# EAGLE schematic Yocto v2.007 (EAGLE 6.1), part 3 of 3
## Sheet 18 of 18: Mods
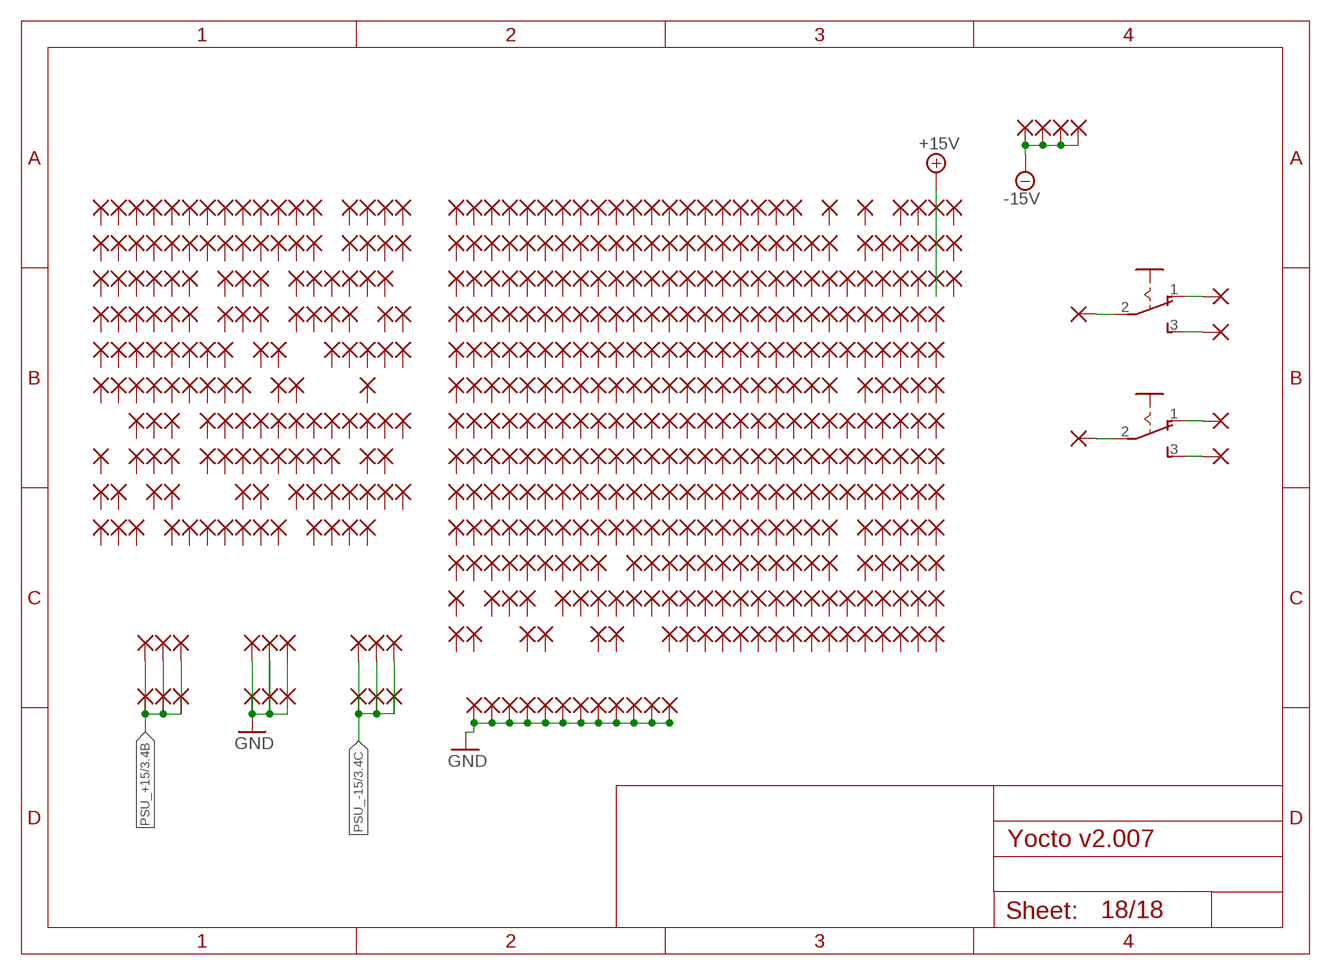
[diagram p18: schematic, sheet 18]

### Parts
MSW1  MSS12  [MSS12_SW_SLIDE]
MSW2  MSS12  [MSS12_SW_SLIDE]
PAD1  1,6/0,8  [1.6/0.8ROUND]
PAD2  1,6/0,8  [1.6/0.8ROUND]
PAD3  1,6/0,8  [1.6/0.8ROUND]
PAD4  1,6/0,8  [1.6/0.8ROUND]
PAD5  1,6/0,8  [1.6/0.8ROUND]
PAD6  1,6/0,8  [1.6/0.8ROUND]
PAD7  1,6/0,8  [1.6/0.8ROUND]
PAD8  1,6/0,8  [1.6/0.8ROUND]
PAD9  1,6/0,8  [1.6/0.8ROUND]
PAD10  1,6/0,8  [1.6/0.8ROUND]
PAD11  1,6/0,8  [1.6/0.8ROUND]
PAD12  1,6/0,8  [1.6/0.8ROUND]
PAD13  1,6/0,8  [1.6/0.8ROUND]
PAD14  1,6/0,8  [1.6/0.8ROUND]
PAD15  1,6/0,8  [1.6/0.8ROUND]
PAD16  1,6/0,8  [1.6/0.8ROUND]
PAD17  1,6/0,8  [1.6/0.8ROUND]
PAD18  1,6/0,8  [1.6/0.8ROUND]
PAD19  1,6/0,8  [1.6/0.8ROUND]
PAD20  1,6/0,8  [1.6/0.8ROUND]
PAD21  1,6/0,8  [1.6/0.8ROUND]
PAD22  1,6/0,8  [1.6/0.8ROUND]
PAD23  1,6/0,8  [1.6/0.8ROUND]
PAD24  1,6/0,8  [1.6/0.8ROUND]
PAD25  1,6/0,8  [1.6/0.8ROUND]
PAD26  1,6/0,8  [1.6/0.8ROUND]
PAD27  1,6/0,8  [1.6/0.8ROUND]
PAD28  1,6/0,8  [1.6/0.8ROUND]
PAD29  1,6/0,8  [1.6/0.8ROUND]
PAD30  1,6/0,8  [1.6/0.8ROUND]
PAD31  1,6/0,8  [1.6/0.8ROUND]
PAD32  1,6/0,8  [1.6/0.8ROUND]
PAD33  1,6/0,8  [1.6/0.8ROUND]
PAD34  1,6/0,8  [1.6/0.8ROUND]
PAD35  1,6/0,8  [1.6/0.8ROUND]
PAD36  1,6/0,8  [1.6/0.8ROUND]
PAD37  1,6/0,8  [1.6/0.8ROUND]
PAD38  1,6/0,8  [1.6/0.8ROUND]
PAD39  1,6/0,8  [1.6/0.8ROUND]
PAD40  1,6/0,8  [1.6/0.8ROUND]
PAD41  1,6/0,8  [1.6/0.8ROUND]
PAD42  1,6/0,8  [1.6/0.8ROUND]
PAD43  1,6/0,8  [1.6/0.8ROUND]
PAD44  1,6/0,8  [1.6/0.8ROUND]
PAD45  1,6/0,8  [1.6/0.8ROUND]
PAD46  1,6/0,8  [1.6/0.8ROUND]
PAD47  1,6/0,8  [1.6/0.8ROUND]
PAD48  1,6/0,8  [1.6/0.8ROUND]
PAD49  1,6/0,8  [1.6/0.8ROUND]
PAD50  1,6/0,8  [1.6/0.8ROUND]
PAD51  1,6/0,8  [1.6/0.8ROUND]
PAD52  1,6/0,8  [1.6/0.8ROUND]
PAD53  1,6/0,8  [1.6/0.8ROUND]
PAD54  1,6/0,8  [1.6/0.8ROUND]
PAD55  1,6/0,8  [1.6/0.8ROUND]
PAD56  1,6/0,8  [1.6/0.8ROUND]
PAD57  1,6/0,8  [1.6/0.8ROUND]
PAD58  1,6/0,8  [1.6/0.8ROUND]
PAD59  1,6/0,8  [1.6/0.8ROUND]
PAD60  1,6/0,8  [1.6/0.8ROUND]
PAD61  1,6/0,8  [1.6/0.8ROUND]
PAD62  1,6/0,8  [1.6/0.8ROUND]
PAD63  1,6/0,8  [1.6/0.8ROUND]
PAD64  1,6/0,8  [1.6/0.8ROUND]
PAD65  1,6/0,8  [1.6/0.8ROUND]
PAD66  1,6/0,8  [1.6/0.8ROUND]
PAD67  1,6/0,8  [1.6/0.8ROUND]
PAD68  1,6/0,8  [1.6/0.8ROUND]
PAD69  1,6/0,8  [1.6/0.8ROUND]
PAD70  1,6/0,8  [1.6/0.8ROUND]
PAD71  1,6/0,8  [1.6/0.8ROUND]
PAD72  1,6/0,8  [1.6/0.8ROUND]
PAD73  1,6/0,8  [1.6/0.8ROUND]
PAD74  1,6/0,8  [1.6/0.8ROUND]
PAD75  1,6/0,8  [1.6/0.8ROUND]
PAD76  1,6/0,8  [1.6/0.8ROUND]
PAD77  1,6/0,8  [1.6/0.8ROUND]
PAD78  1,6/0,8  [1.6/0.8ROUND]
PAD79  1,6/0,8  [1.6/0.8ROUND]
PAD80  1,6/0,8  [1.6/0.8ROUND]
PAD81  1,6/0,8  [1.6/0.8ROUND]
PAD82  1,6/0,8  [1.6/0.8ROUND]
PAD83  1,6/0,8  [1.6/0.8ROUND]
PAD84  1,6/0,8  [1.6/0.8ROUND]
PAD85  1,6/0,8  [1.6/0.8ROUND]
PAD86  1,6/0,8  [1.6/0.8ROUND]
PAD87  1,6/0,8  [1.6/0.8ROUND]
PAD88  1,6/0,8  [1.6/0.8ROUND]
PAD89  1,6/0,8  [1.6/0.8ROUND]
PAD90  1,6/0,8  [1.6/0.8ROUND]
PAD91  1,6/0,8  [1.6/0.8ROUND]
PAD92  1,6/0,8  [1.6/0.8ROUND]
PAD93  1,6/0,8  [1.6/0.8ROUND]
PAD94  1,6/0,8  [1.6/0.8ROUND]
PAD95  1,6/0,8  [1.6/0.8ROUND]
PAD96  1,6/0,8  [1.6/0.8ROUND]
PAD97  1,6/0,8  [1.6/0.8ROUND]
PAD98  1,6/0,8  [1.6/0.8ROUND]
PAD99  1,6/0,8  [1.6/0.8ROUND]
PAD100  1,6/0,8  [1.6/0.8ROUND]
PAD101  1,6/0,8  [1.6/0.8ROUND]
PAD102  1,6/0,8  [1.6/0.8ROUND]
PAD103  1,6/0,8  [1.6/0.8ROUND]
PAD104  1,6/0,8  [1.6/0.8ROUND]
PAD105  1,6/0,8  [1.6/0.8ROUND]
PAD106  1,6/0,8  [1.6/0.8ROUND]
PAD107  1,6/0,8  [1.6/0.8ROUND]
PAD108  1,6/0,8  [1.6/0.8ROUND]
PAD109  1,6/0,8  [1.6/0.8ROUND]
PAD110  1,6/0,8  [1.6/0.8ROUND]
PAD111  1,6/0,8  [1.6/0.8ROUND]
PAD112  1,6/0,8  [1.6/0.8ROUND]
PAD113  1,6/0,8  [1.6/0.8ROUND]
PAD114  1,6/0,8  [1.6/0.8ROUND]
PAD115  1,6/0,8  [1.6/0.8ROUND]
PAD116  1,6/0,8  [1.6/0.8ROUND]
PAD117  1,6/0,8  [1.6/0.8ROUND]
PAD118  1,6/0,8  [1.6/0.8ROUND]
PAD119  1,6/0,8  [1.6/0.8ROUND]
PAD120  1,6/0,8  [1.6/0.8ROUND]
PAD121  1,6/0,8  [1.6/0.8ROUND]
PAD122  1,6/0,8  [1.6/0.8ROUND]
PAD123  1,6/0,8  [1.6/0.8ROUND]
PAD124  1,6/0,8  [1.6/0.8ROUND]
PAD125  1,6/0,8  [1.6/0.8ROUND]
PAD126  1,6/0,8  [1.6/0.8ROUND]
PAD127  1,6/0,8  [1.6/0.8ROUND]
PAD128  1,6/0,8  [1.6/0.8ROUND]
PAD129  1,6/0,8  [1.6/0.8ROUND]
PAD130  1,6/0,8  [1.6/0.8ROUND]
PAD131  1,6/0,8  [1.6/0.8ROUND]
PAD132  1,6/0,8  [1.6/0.8ROUND]
PAD133  1,6/0,8  [1.6/0.8ROUND]
PAD134  1,6/0,8  [1.6/0.8ROUND]
PAD135  1,6/0,8  [1.6/0.8ROUND]
PAD136  1,6/0,8  [1.6/0.8ROUND]
PAD137  1,6/0,8  [1.6/0.8ROUND]
PAD138  1,6/0,8  [1.6/0.8ROUND]
PAD139  1,6/0,8  [1.6/0.8ROUND]
PAD140  1,6/0,8  [1.6/0.8ROUND]
PAD141  1,6/0,8  [1.6/0.8ROUND]
PAD142  1,6/0,8  [1.6/0.8ROUND]
PAD143  1,6/0,8  [1.6/0.8ROUND]
PAD144  1,6/0,8  [1.6/0.8ROUND]
PAD145  1,6/0,8  [1.6/0.8ROUND]
PAD146  1,6/0,8  [1.6/0.8ROUND]
PAD147  1,6/0,8  [1.6/0.8ROUND]
PAD148  1,6/0,8  [1.6/0.8ROUND]
PAD149  1,6/0,8  [1.6/0.8ROUND]
PAD150  1,6/0,8  [1.6/0.8ROUND]
PAD151  1,6/0,8  [1.6/0.8ROUND]
PAD152  1,6/0,8  [1.6/0.8ROUND]
PAD153  1,6/0,8  [1.6/0.8ROUND]
PAD154  1,6/0,8  [1.6/0.8ROUND]
PAD155  1,6/0,8  [1.6/0.8ROUND]
PAD156  1,6/0,8  [1.6/0.8ROUND]
PAD157  1,6/0,8  [1.6/0.8ROUND]
PAD158  1,6/0,8  [1.6/0.8ROUND]
PAD159  1,6/0,8  [1.6/0.8ROUND]
PAD160  1,6/0,8  [1.6/0.8ROUND]
PAD161  1,6/0,8  [1.6/0.8ROUND]
PAD162  1,6/0,8  [1.6/0.8ROUND]
PAD163  1,6/0,8  [1.6/0.8ROUND]
PAD164  1,6/0,8  [1.6/0.8ROUND]
PAD165  1,6/0,8  [1.6/0.8ROUND]
PAD166  1,6/0,8  [1.6/0.8ROUND]
PAD167  1,6/0,8  [1.6/0.8ROUND]
PAD168  1,6/0,8  [1.6/0.8ROUND]
PAD169  1,6/0,8  [1.6/0.8ROUND]
PAD170  1,6/0,8  [1.6/0.8ROUND]
PAD171  1,6/0,8  [1.6/0.8ROUND]
PAD172  1,6/0,8  [1.6/0.8ROUND]
PAD173  1,6/0,8  [1.6/0.8ROUND]
PAD174  1,6/0,8  [1.6/0.8ROUND]
PAD175  1,6/0,8  [1.6/0.8ROUND]
PAD176  1,6/0,8  [1.6/0.8ROUND]
PAD177  1,6/0,8  [1.6/0.8ROUND]
PAD178  1,6/0,8  [1.6/0.8ROUND]
PAD179  1,6/0,8  [1.6/0.8ROUND]
PAD180  1,6/0,8  [1.6/0.8ROUND]
PAD181  1,6/0,8  [1.6/0.8ROUND]
PAD182  1,6/0,8  [1.6/0.8ROUND]
PAD183  1,6/0,8  [1.6/0.8ROUND]
PAD184  1,6/0,8  [1.6/0.8ROUND]
PAD185  1,6/0,8  [1.6/0.8ROUND]
PAD186  1,6/0,8  [1.6/0.8ROUND]
PAD187  1,6/0,8  [1.6/0.8ROUND]
PAD188  1,6/0,8  [1.6/0.8ROUND]
PAD189  1,6/0,8  [1.6/0.8ROUND]
PAD190  1,6/0,8  [1.6/0.8ROUND]
PAD191  1,6/0,8  [1.6/0.8ROUND]
PAD192  1,6/0,8  [1.6/0.8ROUND]
PAD193  1,6/0,8  [1.6/0.8ROUND]
PAD194  1,6/0,8  [1.6/0.8ROUND]
PAD195  1,6/0,8  [1.6/0.8ROUND]
PAD196  1,6/0,8  [1.6/0.8ROUND]
PAD197  1,6/0,8  [1.6/0.8ROUND]
PAD198  1,6/0,8  [1.6/0.8ROUND]
PAD199  1,6/0,8  [1.6/0.8ROUND]
PAD200  1,6/0,8  [1.6/0.8ROUND]
PAD201  1,6/0,8  [1.6/0.8ROUND]
PAD202  1,6/0,8  [1.6/0.8ROUND]
PAD203  1,6/0,8  [1.6/0.8ROUND]
PAD204  1,6/0,8  [1.6/0.8ROUND]
PAD205  1,6/0,8  [1.6/0.8ROUND]
PAD206  1,6/0,8  [1.6/0.8ROUND]
PAD207  1,6/0,8  [1.6/0.8ROUND]
PAD208  1,6/0,8  [1.6/0.8ROUND]
PAD209  1,6/0,8  [1.6/0.8ROUND]
PAD210  1,6/0,8  [1.6/0.8ROUND]
PAD211  1,6/0,8  [1.6/0.8ROUND]
PAD212  1,6/0,8  [1.6/0.8ROUND]
PAD213  1,6/0,8  [1.6/0.8ROUND]
PAD214  1,6/0,8  [1.6/0.8ROUND]
PAD215  1,6/0,8  [1.6/0.8ROUND]
PAD216  1,6/0,8  [1.6/0.8ROUND]
PAD217  1,6/0,8  [1.6/0.8ROUND]
PAD218  1,6/0,8  [1.6/0.8ROUND]
PAD219  1,6/0,8  [1.6/0.8ROUND]
PAD220  1,6/0,8  [1.6/0.8ROUND]
PAD221  1,6/0,8  [1.6/0.8ROUND]
PAD222  1,6/0,8  [1.6/0.8ROUND]
PAD223  1,6/0,8  [1.6/0.8ROUND]
PAD224  1,6/0,8  [1.6/0.8ROUND]
PAD225  1,6/0,8  [1.6/0.8ROUND]
PAD226  1,6/0,8  [1.6/0.8ROUND]
PAD227  1,6/0,8  [1.6/0.8ROUND]
PAD228  1,6/0,8  [1.6/0.8ROUND]
PAD229  1,6/0,8  [1.6/0.8ROUND]
PAD230  1,6/0,8  [1.6/0.8ROUND]
PAD231  1,6/0,8  [1.6/0.8ROUND]
PAD232  1,6/0,8  [1.6/0.8ROUND]
PAD233  1,6/0,8  [1.6/0.8ROUND]
PAD234  1,6/0,8  [1.6/0.8ROUND]
PAD235  1,6/0,8  [1.6/0.8ROUND]
PAD236  1,6/0,8  [1.6/0.8ROUND]
PAD237  1,6/0,8  [1.6/0.8ROUND]
PAD238  1,6/0,8  [1.6/0.8ROUND]
PAD239  1,6/0,8  [1.6/0.8ROUND]
PAD240  1,6/0,8  [1.6/0.8ROUND]
PAD241  1,6/0,8  [1.6/0.8ROUND]
PAD242  1,6/0,8  [1.6/0.8ROUND]
PAD243  1,6/0,8  [1.6/0.8ROUND]
PAD244  1,6/0,8  [1.6/0.8ROUND]
PAD245  1,6/0,8  [1.6/0.8ROUND]
PAD246  1,6/0,8  [1.6/0.8ROUND]
PAD247  1,6/0,8  [1.6/0.8ROUND]
PAD248  1,6/0,8  [1.6/0.8ROUND]
PAD249  1,6/0,8  [1.6/0.8ROUND]
PAD250  1,6/0,8  [1.6/0.8ROUND]
PAD251  1,6/0,8  [1.6/0.8ROUND]
PAD252  1,6/0,8  [1.6/0.8ROUND]
PAD253  1,6/0,8  [1.6/0.8ROUND]
PAD254  1,6/0,8  [1.6/0.8ROUND]
PAD255  1,6/0,8  [1.6/0.8ROUND]
PAD256  1,6/0,8  [1.6/0.8ROUND]
PAD257  1,6/0,8  [1.6/0.8ROUND]
PAD258  1,6/0,8  [1.6/0.8ROUND]
PAD259  1,6/0,8  [1.6/0.8ROUND]
PAD260  1,6/0,8  [1.6/0.8ROUND]
PAD261  1,6/0,8  [1.6/0.8ROUND]
PAD262  1,6/0,8  [1.6/0.8ROUND]
PAD263  1,6/0,8  [1.6/0.8ROUND]
PAD264  1,6/0,8  [1.6/0.8ROUND]
PAD265  1,6/0,8  [1.6/0.8ROUND]
PAD266  1,6/0,8  [1.6/0.8ROUND]
PAD267  1,6/0,8  [1.6/0.8ROUND]
PAD268  1,6/0,8  [1.6/0.8ROUND]
PAD269  1,6/0,8  [1.6/0.8ROUND]
PAD270  1,6/0,8  [1.6/0.8ROUND]
PAD271  1,6/0,8  [1.6/0.8ROUND]
PAD272  1,6/0,8  [1.6/0.8ROUND]
PAD273  1,6/0,8  [1.6/0.8ROUND]
PAD274  1,6/0,8  [1.6/0.8ROUND]
PAD275  1,6/0,8  [1.6/0.8ROUND]
PAD276  1,6/0,8  [1.6/0.8ROUND]
PAD277  1,6/0,8  [1.6/0.8ROUND]
PAD278  1,6/0,8  [1.6/0.8ROUND]
PAD279  1,6/0,8  [1.6/0.8ROUND]
PAD280  1,6/0,8  [1.6/0.8ROUND]
PAD281  1,6/0,8  [1.6/0.8ROUND]
PAD282  1,6/0,8  [1.6/0.8ROUND]
PAD283  1,6/0,8  [1.6/0.8ROUND]
PAD284  1,6/0,8  [1.6/0.8ROUND]
PAD285  1,6/0,8  [1.6/0.8ROUND]
PAD286  1,6/0,8  [1.6/0.8ROUND]
PAD287  1,6/0,8  [1.6/0.8ROUND]
PAD288  1,6/0,8  [1.6/0.8ROUND]
PAD289  1,6/0,8  [1.6/0.8ROUND]
PAD290  1,6/0,8  [1.6/0.8ROUND]
PAD291  1,6/0,8  [1.6/0.8ROUND]
PAD292  1,6/0,8  [1.6/0.8ROUND]
PAD293  1,6/0,8  [1.6/0.8ROUND]
PAD294  1,6/0,8  [1.6/0.8ROUND]
PAD295  1,6/0,8  [1.6/0.8ROUND]
PAD296  1,6/0,8  [1.6/0.8ROUND]
PAD297  1,6/0,8  [1.6/0.8ROUND]
PAD298  1,6/0,8  [1.6/0.8ROUND]
PAD299  1,6/0,8  [1.6/0.8ROUND]
PAD300  1,6/0,8  [1.6/0.8ROUND]
PAD301  1,6/0,8  [1.6/0.8ROUND]
PAD302  1,6/0,8  [1.6/0.8ROUND]
PAD303  1,6/0,8  [1.6/0.8ROUND]
PAD304  1,6/0,8  [1.6/0.8ROUND]
PAD305  1,6/0,8  [1.6/0.8ROUND]
PAD306  1,6/0,8  [1.6/0.8ROUND]
PAD307  1,6/0,8  [1.6/0.8ROUND]
PAD308  1,6/0,8  [1.6/0.8ROUND]
PAD309  1,6/0,8  [1.6/0.8ROUND]
PAD310  1,6/0,8  [1.6/0.8ROUND]
PAD311  1,6/0,8  [1.6/0.8ROUND]
PAD312  1,6/0,8  [1.6/0.8ROUND]
PAD313  1,6/0,8  [1.6/0.8ROUND]
PAD314  1,6/0,8  [1.6/0.8ROUND]
PAD315  1,6/0,8  [1.6/0.8ROUND]
PAD316  1,6/0,8  [1.6/0.8ROUND]
PAD317  1,6/0,8  [1.6/0.8ROUND]
PAD318  1,6/0,8  [1.6/0.8ROUND]
PAD319  1,6/0,8  [1.6/0.8ROUND]
PAD320  1,6/0,8  [1.6/0.8ROUND]
PAD321  1,6/0,8  [1.6/0.8ROUND]
PAD322  1,6/0,8  [1.6/0.8ROUND]
PAD323  1,6/0,8  [1.6/0.8ROUND]
PAD324  1,6/0,8  [1.6/0.8ROUND]
PAD325  1,6/0,8  [1.6/0.8ROUND]
PAD326  1,6/0,8  [1.6/0.8ROUND]
PAD327  1,6/0,8  [1.6/0.8ROUND]
PAD328  1,6/0,8  [1.6/0.8ROUND]
PAD329  1,6/0,8  [1.6/0.8ROUND]
PAD330  1,6/0,8  [1.6/0.8ROUND]
PAD331  1,6/0,8  [1.6/0.8ROUND]
PAD332  1,6/0,8  [1.6/0.8ROUND]
PAD333  1,6/0,8  [1.6/0.8ROUND]
PAD334  1,6/0,8  [1.6/0.8ROUND]
PAD335  1,6/0,8  [1.6/0.8ROUND]
PAD336  1,6/0,8  [1.6/0.8ROUND]
PAD337  1,6/0,8  [1.6/0.8ROUND]
PAD338  1,6/0,8  [1.6/0.8ROUND]
PAD339  1,6/0,8  [1.6/0.8ROUND]
PAD340  1,6/0,8  [1.6/0.8ROUND]
PAD341  1,6/0,8  [1.6/0.8ROUND]
PAD342  1,6/0,8  [1.6/0.8ROUND]
PAD343  1,6/0,8  [1.6/0.8ROUND]
PAD344  1,6/0,8  [1.6/0.8ROUND]
PAD345  1,6/0,8  [1.6/0.8ROUND]
PAD346  1,6/0,8  [1.6/0.8ROUND]
PAD347  1,6/0,8  [1.6/0.8ROUND]
PAD348  1,6/0,8  [1.6/0.8ROUND]
PAD349  1,6/0,8  [1.6/0.8ROUND]
PAD350  1,6/0,8  [1.6/0.8ROUND]
PAD351  1,6/0,8  [1.6/0.8ROUND]
PAD352  1,6/0,8  [1.6/0.8ROUND]
PAD353  1,6/0,8  [1.6/0.8ROUND]
PAD354  1,6/0,8  [1.6/0.8ROUND]
PAD355  1,6/0,8  [1.6/0.8ROUND]
PAD356  1,6/0,8  [1.6/0.8ROUND]
PAD357  1,6/0,8  [1.6/0.8ROUND]
PAD358  1,6/0,8  [1.6/0.8ROUND]
PAD359  1,6/0,8  [1.6/0.8ROUND]
PAD360  1,6/0,8  [1.6/0.8ROUND]
PAD361  1,6/0,8  [1.6/0.8ROUND]
PAD362  1,6/0,8  [1.6/0.8ROUND]
PAD363  1,6/0,8  [1.6/0.8ROUND]
PAD364  1,6/0,8  [1.6/0.8ROUND]
PAD365  1,6/0,8  [1.6/0.8ROUND]
PAD366  1,6/0,8  [1.6/0.8ROUND]
PAD367  1,6/0,8  [1.6/0.8ROUND]
PAD368  1,6/0,8  [1.6/0.8ROUND]
PAD369  1,6/0,8  [1.6/0.8ROUND]
PAD370  1,6/0,8  [1.6/0.8ROUND]
PAD371  1,6/0,8  [1.6/0.8ROUND]
PAD372  1,6/0,8  [1.6/0.8ROUND]
PAD373  1,6/0,8  [1.6/0.8ROUND]
PAD374  1,6/0,8  [1.6/0.8ROUND]
PAD375  1,6/0,8  [1.6/0.8ROUND]
PAD376  1,6/0,8  [1.6/0.8ROUND]
PAD377  1,6/0,8  [1.6/0.8ROUND]
PAD378  1,6/0,8  [1.6/0.8ROUND]
PAD379  1,6/0,8  [1.6/0.8ROUND]
PAD380  1,6/0,8  [1.6/0.8ROUND]
PAD381  1,6/0,8  [1.6/0.8ROUND]
PAD382  1,6/0,8  [1.6/0.8ROUND]
PAD383  1,6/0,8  [1.6/0.8ROUND]
PAD384  1,6/0,8  [1.6/0.8ROUND]
PAD385  1,6/0,8  [1.6/0.8ROUND]
PAD386  1,6/0,8  [1.6/0.8ROUND]
PAD387  1,6/0,8  [1.6/0.8ROUND]
PAD388  1,6/0,8  [1.6/0.8ROUND]
PAD389  1,6/0,8  [1.6/0.8ROUND]
PAD390  1,6/0,8  [1.6/0.8ROUND]
PAD391  1,6/0,8  [1.6/0.8ROUND]
PAD392  1,6/0,8  [1.6/0.8ROUND]
PAD393  1,6/0,8  [1.6/0.8ROUND]
PAD394  1,6/0,8  [1.6/0.8ROUND]
PAD395  1,6/0,8  [1.6/0.8ROUND]
PAD396  1,6/0,8  [1.6/0.8ROUND]
PAD397  1,6/0,8  [1.6/0.8ROUND]
PAD398  1,6/0,8  [1.6/0.8ROUND]
PAD399  1,6/0,8  [1.6/0.8ROUND]
PAD400  1,6/0,8  [1.6/0.8ROUND]
PAD401  1,6/0,8  [1.6/0.8ROUND]
PAD402  1,6/0,8  [1.6/0.8ROUND]
PAD403  1,6/0,8  [1.6/0.8ROUND]
PAD404  1,6/0,8  [1.6/0.8ROUND]
PAD405  1,6/0,8  [1.6/0.8ROUND]
PAD406  1,6/0,8  [1.6/0.8ROUND]
PAD407  1,6/0,8  [1.6/0.8ROUND]
PAD408  1,6/0,8  [1.6/0.8ROUND]
PAD409  1,6/0,8  [1.6/0.8ROUND]
PAD410  1,6/0,8  [1.6/0.8ROUND]
PAD411  1,6/0,8  [1.6/0.8ROUND]
PAD412  1,6/0,8  [1.6/0.8ROUND]
PAD413  1,6/0,8  [1.6/0.8ROUND]
PAD414  1,6/0,8  [1.6/0.8ROUND]
PAD415  1,6/0,8  [1.6/0.8ROUND]
PAD416  1,6/0,8  [1.6/0.8ROUND]
PAD417  1,6/0,8  [1.6/0.8ROUND]
PAD418  1,6/0,8  [1.6/0.8ROUND]
PAD419  1,6/0,8  [1.6/0.8ROUND]
PAD420  1,6/0,8  [1.6/0.8ROUND]
PAD421  1,6/0,8  [1.6/0.8ROUND]
PAD422  1,6/0,8  [1.6/0.8ROUND]
PAD423  1,6/0,8  [1.6/0.8ROUND]
PAD424  1,6/0,8  [1.6/0.8ROUND]
PAD425  1,6/0,8  [1.6/0.8ROUND]
PAD426  1,6/0,8  [1.6/0.8ROUND]
PAD427  1,6/0,8  [1.6/0.8ROUND]
PAD428  1,6/0,8  [1.6/0.8ROUND]
PAD429  1,6/0,8  [1.6/0.8ROUND]
PAD430  1,6/0,8  [1.6/0.8ROUND]
PAD431  1,6/0,8  [1.6/0.8ROUND]
PAD432  1,6/0,8  [1.6/0.8ROUND]
PAD433  1,6/0,8  [1.6/0.8ROUND]
PAD434  1,6/0,8  [1.6/0.8ROUND]
PAD435  1,6/0,8  [1.6/0.8ROUND]
PAD436  1,6/0,8  [1.6/0.8ROUND]
PAD437  1,6/0,8  [1.6/0.8ROUND]
PAD438  1,6/0,8  [1.6/0.8ROUND]
PAD439  1,6/0,8  [1.6/0.8ROUND]
PAD440  1,6/0,8  [1.6/0.8ROUND]
PAD441  1,6/0,8  [1.6/0.8ROUND]
PAD442  1,6/0,8  [1.6/0.8ROUND]
PAD443  1,6/0,8  [1.6/0.8ROUND]
PAD444  1,6/0,8  [1.6/0.8ROUND]
PAD446  1,6/0,8  [1.6/0.8ROUND]
PAD447  1,6/0,8  [1.6/0.8ROUND]
PAD448  1,6/0,8  [1.6/0.8ROUND]
PAD449  1,6/0,8  [1.6/0.8ROUND]
PAD450  1,6/0,8  [1.6/0.8ROUND]
PAD451  1,6/0,8  [1.6/0.8ROUND]
PAD452  1,6/0,8  [1.6/0.8ROUND]
PAD453  1,6/0,8  [1.6/0.8ROUND]
PAD454  1,6/0,8  [1.6/0.8ROUND]
PAD455  1,6/0,8  [1.6/0.8ROUND]
PAD456  1,6/0,8  [1.6/0.8ROUND]
PAD458  1,6/0,8  [1.6/0.8ROUND]
PAD459  1,6/0,8  [1.6/0.8ROUND]
PAD460  1,6/0,8  [1.6/0.8ROUND]
PAD461  1,6/0,8  [1.6/0.8ROUND]
PAD462  1,6/0,8  [1.6/0.8ROUND]
PAD463  1,6/0,8  [1.6/0.8ROUND]
PAD464  1,6/0,8  [1.6/0.8ROUND]
PAD465  1,6/0,8  [1.6/0.8ROUND]
PAD466  1,6/0,8  [1.6/0.8ROUND]
PAD467  1,6/0,8  [1.6/0.8ROUND]
PAD468  1,6/0,8  [1.6/0.8ROUND]
PAD470  1,6/0,8  [1.6/0.8ROUND]
PAD471  1,6/0,8  [1.6/0.8ROUND]
PAD472  1,6/0,8  [1.6/0.8ROUND]
PAD473  1,6/0,8  [1.6/0.8ROUND]
PAD474  1,6/0,8  [1.6/0.8ROUND]
PAD475  1,6/0,8  [1.6/0.8ROUND]
PAD476  1,6/0,8  [1.6/0.8ROUND]
PAD477  1,6/0,8  [1.6/0.8ROUND]
PAD478  1,6/0,8  [1.6/0.8ROUND]
PAD479  1,6/0,8  [1.6/0.8ROUND]
PAD480  1,6/0,8  [1.6/0.8ROUND]
PAD482  1,6/0,8  [1.6/0.8ROUND]
PAD483  1,6/0,8  [1.6/0.8ROUND]
PAD484  1,6/0,8  [1.6/0.8ROUND]
PAD485  1,6/0,8  [1.6/0.8ROUND]
PAD486  1,6/0,8  [1.6/0.8ROUND]
PAD487  1,6/0,8  [1.6/0.8ROUND]
PAD488  1,6/0,8  [1.6/0.8ROUND]
PAD489  1,6/0,8  [1.6/0.8ROUND]
PAD490  1,6/0,8  [1.6/0.8ROUND]
PAD491  1,6/0,8  [1.6/0.8ROUND]
PAD492  1,6/0,8  [1.6/0.8ROUND]
PAD494  1,6/0,8  [1.6/0.8ROUND]
PAD495  1,6/0,8  [1.6/0.8ROUND]
PAD496  1,6/0,8  [1.6/0.8ROUND]
PAD497  1,6/0,8  [1.6/0.8ROUND]
PAD498  1,6/0,8  [1.6/0.8ROUND]
PAD499  1,6/0,8  [1.6/0.8ROUND]
PAD500  1,6/0,8  [1.6/0.8ROUND]
PAD501  1,6/0,8  [1.6/0.8ROUND]
PAD502  1,6/0,8  [1.6/0.8ROUND]
PAD503  1,6/0,8  [1.6/0.8ROUND]
PAD506  1,6/0,8  [1.6/0.8ROUND]
PAD507  1,6/0,8  [1.6/0.8ROUND]
PAD508  1,6/0,8  [1.6/0.8ROUND]
PAD509  1,6/0,8  [1.6/0.8ROUND]
PAD510  1,6/0,8  [1.6/0.8ROUND]
PAD511  1,6/0,8  [1.6/0.8ROUND]
PAD512  1,6/0,8  [1.6/0.8ROUND]
PAD513  1,6/0,8  [1.6/0.8ROUND]
PAD514  1,6/0,8  [1.6/0.8ROUND]
PAD515  1,6/0,8  [1.6/0.8ROUND]
PAD518  1,6/0,8  [1.6/0.8ROUND]
PAD519  1,6/0,8  [1.6/0.8ROUND]
PAD520  1,6/0,8  [1.6/0.8ROUND]
PAD521  1,6/0,8  [1.6/0.8ROUND]
PAD522  1,6/0,8  [1.6/0.8ROUND]
PAD523  1,6/0,8  [1.6/0.8ROUND]
PAD524  1,6/0,8  [1.6/0.8ROUND]
PAD525  1,6/0,8  [1.6/0.8ROUND]
PAD526  1,6/0,8  [1.6/0.8ROUND]
PAD527  1,6/0,8  [1.6/0.8ROUND]
PAD530  1,6/0,8  [1.6/0.8ROUND]
PAD531  1,6/0,8  [1.6/0.8ROUND]
PAD532  1,6/0,8  [1.6/0.8ROUND]
PAD533  1,6/0,8  [1.6/0.8ROUND]
PAD534  1,6/0,8  [1.6/0.8ROUND]
PAD535  1,6/0,8  [1.6/0.8ROUND]
PAD536  1,6/0,8  [1.6/0.8ROUND]
PAD537  1,6/0,8  [1.6/0.8ROUND]
PAD538  1,6/0,8  [1.6/0.8ROUND]
PAD539  1,6/0,8  [1.6/0.8ROUND]
PAD542  1,6/0,8  [1.6/0.8ROUND]
PAD543  1,6/0,8  [1.6/0.8ROUND]
PAD544  1,6/0,8  [1.6/0.8ROUND]
PAD545  1,6/0,8  [1.6/0.8ROUND]
PAD546  1,6/0,8  [1.6/0.8ROUND]
PAD547  1,6/0,8  [1.6/0.8ROUND]
PAD548  1,6/0,8  [1.6/0.8ROUND]
PAD549  1,6/0,8  [1.6/0.8ROUND]
PAD550  1,6/0,8  [1.6/0.8ROUND]
PAD551  1,6/0,8  [1.6/0.8ROUND]

### Nets
+15V [power]: PAD334.1(P) PAD335.1(P) PAD338.1(P) ; also sheet 1,4
-15V [power]: PAD287.1(P) PAD288.1(P) PAD292.1(P) PAD297.1(P) ; also sheet 1,4
GND [GND]: PAD207.1(P) PAD213.1(P) PAD214.1(P) PAD220.1(P) PAD221.1(P) PAD227.1(P) PAD228.1(P) PAD241.1(P) PAD242.1(P) PAD261.1(P) PAD296.1(P) PAD301.1(P) PAD446.1(P) PAD458.1(P) PAD470.1(P) PAD475.1(P) PAD487.1(P) PAD499.1(P) ; also sheet 1,2,3,4,5,6,7,8,9,10,11,12,13,14,15,16,17
N$392: MSW1.1(O) PAD326.1(P)
N$420: MSW1.3(S) PAD327.1(P)
N$428: MSW2.1(O) PAD330.1(P)
N$435: MSW2.3(S) PAD331.1(P)
N$437: MSW2.2(P) PAD329.1(P)
N$438: MSW1.2(P) PAD328.1(P)
PSU_+15: PAD410.1(P) PAD415.1(P) PAD422.1(P) PAD427.1(P) PAD434.1(P) PAD439.1(P) ; also sheet 3
PSU_-15 [power]: PAD432.1(P) PAD494.1(P) PAD506.1(P) PAD518.1(P) PAD535.1(P) PAD547.1(P) ; also sheet 3
Unconnected: MSW1.P$4 MSW1.P$5 MSW1.P$6 MSW1.P$7 MSW2.P$4 MSW2.P$5 MSW2.P$6 MSW2.P$7 PAD1.1(P) PAD2.1(P) PAD3.1(P) PAD4.1(P) PAD5.1(P) PAD6.1(P) PAD7.1(P) PAD8.1(P) PAD9.1(P) PAD10.1(P) PAD11.1(P) PAD12.1(P) PAD13.1(P) PAD14.1(P) PAD15.1(P) PAD16.1(P) PAD17.1(P) PAD18.1(P) PAD19.1(P) PAD20.1(P) PAD21.1(P) PAD22.1(P) PAD23.1(P) PAD24.1(P) PAD25.1(P) PAD26.1(P) PAD27.1(P) PAD28.1(P) PAD29.1(P) PAD30.1(P) PAD31.1(P) PAD32.1(P) PAD33.1(P) PAD34.1(P) PAD35.1(P) PAD36.1(P) PAD37.1(P) PAD38.1(P) PAD39.1(P) PAD40.1(P) PAD41.1(P) PAD42.1(P) PAD43.1(P) PAD44.1(P) PAD45.1(P) PAD46.1(P) PAD47.1(P) PAD48.1(P) PAD49.1(P) PAD50.1(P) PAD51.1(P) PAD52.1(P) PAD53.1(P) PAD54.1(P) PAD55.1(P) PAD56.1(P) PAD57.1(P) PAD58.1(P) PAD59.1(P) PAD60.1(P) PAD61.1(P) PAD62.1(P) PAD63.1(P) PAD64.1(P) PAD65.1(P) PAD66.1(P) PAD67.1(P) PAD68.1(P) PAD69.1(P) PAD70.1(P) PAD71.1(P) PAD72.1(P) PAD73.1(P) PAD74.1(P) PAD75.1(P) PAD76.1(P) PAD77.1(P) PAD78.1(P) PAD79.1(P) PAD80.1(P) PAD81.1(P) PAD82.1(P) PAD83.1(P) PAD84.1(P) PAD85.1(P) PAD86.1(P) PAD87.1(P) PAD88.1(P) PAD89.1(P) PAD90.1(P) PAD91.1(P) PAD92.1(P) PAD93.1(P) PAD94.1(P) PAD95.1(P) PAD96.1(P) PAD97.1(P) PAD98.1(P) PAD99.1(P) PAD100.1(P) PAD101.1(P) PAD102.1(P) PAD103.1(P) PAD104.1(P) PAD105.1(P) PAD106.1(P) PAD107.1(P) PAD108.1(P) PAD109.1(P) PAD110.1(P) PAD111.1(P) PAD112.1(P) PAD113.1(P) PAD114.1(P) PAD115.1(P) PAD116.1(P) PAD117.1(P) PAD118.1(P) PAD119.1(P) PAD120.1(P) PAD121.1(P) PAD122.1(P) PAD123.1(P) PAD124.1(P) PAD125.1(P) PAD126.1(P) PAD127.1(P) PAD128.1(P) PAD129.1(P) PAD130.1(P) PAD131.1(P) PAD132.1(P) PAD133.1(P) PAD134.1(P) PAD135.1(P) PAD136.1(P) PAD137.1(P) PAD138.1(P) PAD139.1(P) PAD140.1(P) PAD141.1(P) PAD142.1(P) PAD143.1(P) PAD144.1(P) PAD145.1(P) PAD146.1(P) PAD147.1(P) PAD148.1(P) PAD149.1(P) PAD150.1(P) PAD151.1(P) PAD152.1(P) PAD153.1(P) PAD154.1(P) PAD155.1(P) PAD156.1(P) PAD157.1(P) PAD158.1(P) PAD159.1(P) PAD160.1(P) PAD161.1(P) PAD162.1(P) PAD163.1(P) PAD164.1(P) PAD165.1(P) PAD166.1(P) PAD167.1(P) PAD168.1(P) PAD169.1(P) PAD170.1(P) PAD171.1(P) PAD172.1(P) PAD173.1(P) PAD174.1(P) PAD175.1(P) PAD176.1(P) PAD177.1(P) PAD178.1(P) PAD179.1(P) PAD180.1(P) PAD181.1(P) PAD182.1(P) PAD183.1(P) PAD184.1(P) PAD185.1(P) PAD186.1(P) PAD187.1(P) PAD188.1(P) PAD189.1(P) PAD190.1(P) PAD191.1(P) PAD192.1(P) PAD193.1(P) PAD194.1(P) PAD195.1(P) PAD196.1(P) PAD197.1(P) PAD198.1(P) PAD199.1(P) PAD200.1(P) PAD201.1(P) PAD202.1(P) PAD203.1(P) PAD204.1(P) PAD205.1(P) PAD206.1(P) PAD208.1(P) PAD209.1(P) PAD210.1(P) PAD211.1(P) PAD212.1(P) PAD215.1(P) PAD216.1(P) PAD217.1(P) PAD218.1(P) PAD219.1(P) PAD222.1(P) PAD223.1(P) PAD224.1(P) PAD225.1(P) PAD226.1(P) PAD229.1(P) PAD230.1(P) PAD231.1(P) PAD232.1(P) PAD233.1(P) PAD234.1(P) PAD235.1(P) PAD236.1(P) PAD237.1(P) PAD238.1(P) PAD239.1(P) PAD240.1(P) PAD243.1(P) PAD244.1(P) PAD245.1(P) PAD246.1(P) PAD247.1(P) PAD248.1(P) PAD249.1(P) PAD250.1(P) PAD251.1(P) PAD252.1(P) PAD253.1(P) PAD254.1(P) PAD255.1(P) PAD256.1(P) PAD257.1(P) PAD258.1(P) PAD259.1(P) PAD260.1(P) PAD262.1(P) PAD263.1(P) PAD264.1(P) PAD265.1(P) PAD266.1(P) PAD267.1(P) PAD268.1(P) PAD269.1(P) PAD270.1(P) PAD271.1(P) PAD272.1(P) PAD273.1(P) PAD274.1(P) PAD275.1(P) PAD276.1(P) PAD277.1(P) PAD278.1(P) PAD279.1(P) PAD280.1(P) PAD281.1(P) PAD282.1(P) PAD283.1(P) PAD284.1(P) PAD285.1(P) PAD286.1(P) PAD289.1(P) PAD290.1(P) PAD291.1(P) PAD293.1(P) PAD294.1(P) PAD295.1(P) PAD298.1(P) PAD299.1(P) PAD300.1(P) PAD302.1(P) PAD303.1(P) PAD304.1(P) PAD305.1(P) PAD306.1(P) PAD307.1(P) PAD308.1(P) PAD309.1(P) PAD310.1(P) PAD311.1(P) PAD312.1(P) PAD313.1(P) PAD314.1(P) PAD315.1(P) PAD316.1(P) PAD317.1(P) PAD318.1(P) PAD319.1(P) PAD320.1(P) PAD321.1(P) PAD322.1(P) PAD323.1(P) PAD324.1(P) PAD325.1(P) PAD332.1(P) PAD333.1(P) PAD336.1(P) PAD337.1(P) PAD339.1(P) PAD340.1(P) PAD341.1(P) PAD342.1(P) PAD343.1(P) PAD344.1(P) PAD345.1(P) PAD346.1(P) PAD347.1(P) PAD348.1(P) PAD349.1(P) PAD350.1(P) PAD351.1(P) PAD352.1(P) PAD353.1(P) PAD354.1(P) PAD355.1(P) PAD356.1(P) PAD357.1(P) PAD358.1(P) PAD359.1(P) PAD360.1(P) PAD361.1(P) PAD362.1(P) PAD363.1(P) PAD364.1(P) PAD365.1(P) PAD366.1(P) PAD367.1(P) PAD368.1(P) PAD369.1(P) PAD370.1(P) PAD371.1(P) PAD372.1(P) PAD373.1(P) PAD374.1(P) PAD375.1(P) PAD376.1(P) PAD377.1(P) PAD378.1(P) PAD379.1(P) PAD380.1(P) PAD381.1(P) PAD382.1(P) PAD383.1(P) PAD384.1(P) PAD385.1(P) PAD386.1(P) PAD387.1(P) PAD388.1(P) PAD389.1(P) PAD390.1(P) PAD391.1(P) PAD392.1(P) PAD393.1(P) PAD394.1(P) PAD395.1(P) PAD396.1(P) PAD397.1(P) PAD398.1(P) PAD399.1(P) PAD400.1(P) PAD401.1(P) PAD402.1(P) PAD403.1(P) PAD404.1(P) PAD405.1(P) PAD406.1(P) PAD407.1(P) PAD408.1(P) PAD409.1(P) PAD411.1(P) PAD412.1(P) PAD413.1(P) PAD414.1(P) PAD416.1(P) PAD417.1(P) PAD418.1(P) PAD419.1(P) PAD420.1(P) PAD421.1(P) PAD423.1(P) PAD424.1(P) PAD425.1(P) PAD426.1(P) PAD428.1(P) PAD429.1(P) PAD430.1(P) PAD431.1(P) PAD433.1(P) PAD435.1(P) PAD436.1(P) PAD437.1(P) PAD438.1(P) PAD440.1(P) PAD441.1(P) PAD442.1(P) PAD443.1(P) PAD444.1(P) PAD447.1(P) PAD448.1(P) PAD449.1(P) PAD450.1(P) PAD451.1(P) PAD452.1(P) PAD453.1(P) PAD454.1(P) PAD455.1(P) PAD456.1(P) PAD459.1(P) PAD460.1(P) PAD461.1(P) PAD462.1(P) PAD463.1(P) PAD464.1(P) PAD465.1(P) PAD466.1(P) PAD467.1(P) PAD468.1(P) PAD471.1(P) PAD472.1(P) PAD473.1(P) PAD474.1(P) PAD476.1(P) PAD477.1(P) PAD478.1(P) PAD479.1(P) PAD480.1(P) PAD482.1(P) PAD483.1(P) PAD484.1(P) PAD485.1(P) PAD486.1(P) PAD488.1(P) PAD489.1(P) PAD490.1(P) PAD491.1(P) PAD492.1(P) PAD495.1(P) PAD496.1(P) PAD497.1(P) PAD498.1(P) PAD500.1(P) PAD501.1(P) PAD502.1(P) PAD503.1(P) PAD507.1(P) PAD508.1(P) PAD509.1(P) PAD510.1(P) PAD511.1(P) PAD512.1(P) PAD513.1(P) PAD514.1(P) PAD515.1(P) PAD519.1(P) PAD520.1(P) PAD521.1(P) PAD522.1(P) PAD523.1(P) PAD524.1(P) PAD525.1(P) PAD526.1(P) PAD527.1(P) PAD530.1(P) PAD531.1(P) PAD532.1(P) PAD533.1(P) PAD534.1(P) PAD536.1(P) PAD537.1(P) PAD538.1(P) PAD539.1(P) PAD542.1(P) PAD543.1(P) PAD544.1(P) PAD545.1(P) PAD546.1(P) PAD548.1(P) PAD549.1(P) PAD550.1(P) PAD551.1(P)

## Library data of the parts
BASSDRUM COWBELL CYMBAL HANCLAP LEFT LOWTOM MID/HITOM OH/CH PC-2 RIGHT/MONO RIMSHOT SNAREDRUM TRIG1 = tr909:JACK_TRS: Neutrik
C1 C26 C36 C39 C41 C42 C48 C54 C79* C82* C142 C149 C153 C169 C188 C189 C192 C193 C513 C521-C524 C600-C612 C614 C615 = TR808clone:C-EU: CAPACITOR, European symbol
C1* C2 C2* C3 C3* C4 C4* C5 C5* C6 C6* C8 C10* C11* C13* C14 C14* C15 C15* C16* C17 C19 C21-C23 C25 C27 C28* C29* C30* C31* C32-C34 C36* C38 C40 C42* C43* C44* C45 C46* C47* C48* C49* C50* C51* C52 C52* C53 C53* C54* C55* C56 C56* C57 C57* C58 C58* C59 C59* C60 C61 C63 C64* C65 C65* C66 C66* C67 C67* C68* C69 C69* C70 C70* C71 C71* C72 C72* C73 C73* C74 C74* C75 C76 C76* C77 C77* C78 C80* C81 C83-C90 C90* C91 C92 C96-C105 C108 C110-C119 C121 C122 C125 C127-C141 C146 C150-C152 C154 C156 C202 C500 C502-C512 C514 C517-C519 = rcl:C-EU: CAPACITOR, European symbol
C7 C9* C12 C12* C13 C18 C24 C24* C25* C26* C27* C29 C31 C32* C33* C34* C35 C35* C37* C38* C39* C40* C41* C44 C45* C46 C51 C55 C60* C61* C62 C62* C63* C64 C68 C75* C78* C79 C80 C81* C82 C83* C84* C85* C88* C89* C93-C95 C106 C107 C109 C120 C123 C124 C126 C143-C145 C147 C148 C157 C241-C243 C252-C255 C515 C520 = rcl:CPOL-EU: POLARIZED CAPACITOR, European symbol
C43 C47 C49 C50 C190 C191 C194-C197 = TR808clone:CPOL-EU: POLARIZED CAPACITOR, European symbol
D1 D2 D2* D3* D4* D5* D6* D7* D8* D11* D12* D13* D14* D54-D71 D80-D85 D98 D193-D195 = diode:1N4148: DIODE high speed (Philips)
D52 D53 = TR808clone:1N4148: DIODE high speed (Philips)
D94-D97 D109-D111 = diode:1N4004: DIODE general purpose rectifier, 1 A
D101 = diode:1N581*: 1.0A SCHOTTKY BARRIER RECTIFIER Source: http://www.diodes.com/datasheets/ds23001.pdf
DAC_OUTB DIN_4 DIN_5 GND TP1 TP2 TP4 TP6 TP7 X4-X7 = testpad:TP: Test pad
DIN_SYNC IN OUT THRU = E-licktonic:MAB5SH: Female CONNECTOR 5 pins 90 deg. with shield, horizontal (DIN 41524); OC_FARNELL: 809883; OC_NEWARK: unknown
DIS1 = display-lcd:TUXGR_16X2_R2: Tuxgraphics LCD display 16x2 characters reflective, without background light Source: tuxgr_12x2_r2.pdf; OC_FARNELL: unknown; OC_NEWARK: unknown
G1-G9 = wirepad:WIREPAD: Wire PAD connect wire on PCB
IC1 IC2 IC110 = linear:TL074: OP AMP
IC3 = 40xx:4049: Hex inverting BUFFER
IC4 = optocoupler:6N138: MOTOROLA OPTO COUPLER; MF: VISHAY/TELEFUNKEN; MPN: 6N138; OC_FARNELL: 9860150; OC_NEWARK: 35K5294
IC6 = linear:TL072: OP AMP
IC19 IC23 = st-microelectronics:M24M02
IC100 IC102 IC104 IC105 IC108 = 74xx-eu:74*165: 8-bit parallel load SHIFT REGISTER
IC101 IC106 IC107 IC112 IC113 IC116 IC117 = 74xx-eu:74*595: 8-bit SHIFT REGISTER, output latch
IC111 IC114 = 40xx:4051: 8-channel ANALOG MULTIPLEXER
IC118 = microchip:MCP4822: Dual 12 Bits DAC with internal Vref and SPI interface
IC119 = atmel:ATMEGA644-*PU: 8-bit Microcontroller with 64K Bytes In-System Programmable Flash Auto generated by make-symbol-device-package-bsdl.ulp Rev. 34 Source: http://www.atmel.com/dyn/resources/prod_documents/doc2593.pdf; MPN: ATMEGA644-20PU; OC_FARNELL: 1288340; OC_NEWARK: 23M5060
ICSP = con-lstb:MA03-2: PIN HEADER; OC_FARNELL: unknown; OC_NEWARK: unknown
J1 J3 J4 J11-J13 = con-molex:22-?-04: CONNECTOR wire to board 2.54 mm (.1 inch) pitch header; OC_FARNELL: unknown; OC_NEWARK: unknown
J2 J10 = con-molex:22-?-08: CONNECTOR wire to board 2.54 mm (.1 inch) pitch header; OC_FARNELL: unknown; OC_NEWARK: unknown
J5 J8 = con-molex:KK-156-4: KK 156 HEADER Source: http://www.molex.com/pdm_docs/sd/026604100_sd.pdf; OC_FARNELL: unknown; OC_NEWARK: unknown
J6 J14 = con-molex:22-?-06: CONNECTOR wire to board 2.54 mm (.1 inch) pitch header; OC_FARNELL: unknown; OC_NEWARK: unknown
J7 = con-lstb:MA05-1: PIN HEADER
J9 = con-molex:KK-156-2: KK 156 HEADER Source: http://www.molex.com/pdm_docs/sd/026604100_sd.pdf; OC_FARNELL: unknown; OC_NEWARK: unknown
J16 = con-jack:JACK-PLUG: DC POWER JACK Power Jack, DC, Right Angle, Through Hole, Rated 5A at 16VDC, PC Terminals Distributor: Farnell (www.Farnell.de) Drawing: 84N1161.pdf / 84N1162.pdf Manufacturer: SPC Technology (www.spctechnology.com) Type: SPC4077 / SPC 4078; OC_FARNELL: unknown; OC_NEWARK: unknown
L1 = inductor-neosid:BS: INDUCTOR nominal inductance, magnetically screened; OC_FARNELL: unknown; OC_NEWARK: unknown
LED1-LED4 = led:LED: LED OSRAM: - CHIPLED LG R971, LG N971, LY N971, LG Q971, LY Q971, LO R971, LY R971 LH N974, LH R974 LS Q976, LO Q976, LY Q976 LO Q996 - Hyper CHIPLED LW Q18S LB Q993, LB Q99A, LB R99A - SideLED LS A670, LO A670, LY A670, LG A670, LP A670 LB A673, LV A673, LT A673, LW A673 LH A674 LY A675 LS A676, LA A676, LO A676, LY A676, LW A676 LS A679, LY A679, LG A679 - Hyper Micro SIDELED® LS Y876, LA Y876, LO Y876, LY Y876 LT Y87S - SmartLED LW L88C, LW L88S LB L89C, LB L89S, LG L890 LS L89K, LO L89K, LY L89K LS L896, LA L896, LO L896, LY L896 - TOPLED LS T670, LO T670, LY T670, LG T670, LP T670 LSG T670, LSP T670, LSY T670, LOP T670, LYG T670 LG T671, LOG T671, LSG T671 LB T673, LV T673, LT T673, LW T673 LH T674 LS T676, LA T676, LO T676, LY T676, LB T676, LH T676, LSB T676, LW T676 LB T67C, LV T67C, LT T67C, LS T67K, LO T67K, LY T67K, LW E67C LS E67B, LA E67B, LO E67B, LY E67B, LB E67C, LV E67C, LT E67C LW T67C LS T679, LY T679, LG T679 LS T770, LO T770, LY T770, LG T770, LP T770 LB T773, LV T773, LT T773, LW T773 LH T774 LS E675, LA E675, LY E675, LS T675 LS T776, LA T776, LO T776, LY T776, LB T776 LHGB T686 LT T68C, LB T68C - Hyper Mini TOPLED® LB M676 - Mini TOPLED Santana® LG M470 LS M47K, LO M47K, LY M47K Source: http://www.osram.convergy.de LUXEON: - LUMILED® LXK2-PW12-R00, LXK2-PW12-S00, LXK2-PW14-U00, LXK2-PW14-V00 LXK2-PM12-R00, LXK2-PM12-S00, LXK2-PM14-U00 LXK2-PE12-Q00, LXK2-PE12-R00, LXK2-PE12-S00, LXK2-PE14-T00, LXK2-PE14-U00 LXK2-PB12-K00, LXK2-PB12-L00, LXK2-PB12-M00, LXK2-PB14-N00, LXK2-PB14-P00, LXK2-PB14-Q00 LXK2-PR12-L00, LXK2-PR12-M00, LXK2-PR14-Q00, LXK2-PR14-R00 LXK2-PD12-Q00, LXK2-PD12-R00, LXK2-PD12-S00 LXK2-PH12-R00, LXK2-PH12-S00 LXK2-PL12-P00, LXK2-PL12-Q00, LXK2-PL12-R00 Source: www.luxeon.com KINGBRIGHT: KA-3528ASYC Source: www.kingbright.com
M1-M16 VR1 VR2 VR2* VR3 VR3* VR4 VR4* VR5 VR5* VR6 VR6* VR7 VR7* VR8 VR8* VR9-VR20 = TR808clone:POT_808
MSW1 MSW2 SW2 SW3 SW12 = Yocto_v2.003:MSS12
PAD1-PAD444 PAD446-PAD456 PAD458-PAD468 PAD470-PAD480 PAD482-PAD492 PAD494-PAD503 PAD506-PAD515 PAD518-PAD527 PAD530-PAD539 PAD542-PAD551 = wirepad:1,6/0,8: THROUGH-HOLE PAD
Q1 Q1* Q2 Q2* Q3* Q4 Q4* Q9* Q14* Q15* Q16* Q17* Q18* Q19* Q20* Q21* Q22* Q23* Q24* Q25* Q26* Q27* Q28 Q28* Q29* Q30* Q31* Q39 Q41-Q45 Q47-Q50 Q52 Q53 Q55 Q56 Q58 Q59 Q61-Q63 Q67-Q70 Q73 = TR808clone:2SC945: NPN Silicon Epitaxial Planar Transistor Source: SEMTECH ELECTRONICS LTD. ... 2SC945 2.pdf
Q3 = Yocto_v2.003:2SA733: PNP Silicon Transistor
Q5 Q5* Q6* Q7* Q8* Q29 Q40 Q46 Q51 Q54 Q57 Q60 Q65 Q66 Q71 Q72 Q79 = TR808clone:2SA733: PNP Silicon Transistor
Q6 Q74 = TR808clone:2SK30
Q35 = TR808clone:2SC828
Q82 Q83 = tr909:2SC2878
Q86 = transistor-pnp:2N3906: PNP Transistor
R1 R1* R2 R2* R3 R3* R4 R4* R5 R5* R6 R6* R7 R7* R8 R8* R9 R9* R10 R10* R11 R11* R12 R12* R13 R13* R14 R14* R15 R15* R16 R16* R17 R17* R18-R24 R24* R25 R25* R26 R27 R27* R28 R28* R29 R29* R30 R30* R31 R31* R32 R32* R33 R33* R34 R35 R35* R36 R37 R37* R38 R39 R39* R40 R40* R41 R41* R42 R42* R43 R43* R44 R44* R45 R45* R46 R46* R47 R48 R48* R49 R50 R50* R51 R52 R52* R53 R53* R54 R55* R56* R57* R58 R58* R59 R59* R60 R60* R61* R62* R63* R64* R65* R78* R79* R80* R81* R82* R83* R84* R85* R86* R87* R88* R89* R90* R91* R92* R93* R94* R95* R96* R97* R98* R99* R100* R101* R102* R103 R103* R104 R104* R105 R105* R106 R106* R107 R107* R108 R109* R110* R111* R112* R113* R114* R115* R116* R117* R119* R120* R121* R122* R123* R124 R124* R125* R126* R127* R128 R129* R130 R130* R131 R131* R132 R132* R133 R133* R135* R136* R137* R138* R139* R140* R141* R142* R143* R144* R145* R146* R147* R148* R149* R150* R151* R152 R152* R153 R153* R154* R155* R156* R157* R158* R159* R160* R161* R162* R163* R164* R165* R166* R169* R170* R171* R172* R173* R178-R187 R189-R200 R200' R201-R258 R260-R358 R360-R377 R379-R383 = rcl:R-EU_: RESISTOR, European symbol
R26* R108* R118* R128* R134* R154-R175 R177 R188 R259 R359 R378 = TR808clone:R-EU_: RESISTOR, European symbol
R55 R56 R78 R79 R468-R474 R501 R502 R504 R505 R507 R508 R510 R511 R513 R514 R516 R517 R519 R520 R522 R523 R525 R526 R528-R533 R535 R536 R550-R552 R688 R691-R693 R695-R697 R699 R700 R712 R714-R719 R726-R728 R730 = rcl:R-US_: RESISTOR, American symbol
R176 = resistor:R-EU_: RESISTOR, European symbol
R600-R647 R655-R665 R667-R687 R694 = resistor:R-US_: RESISTOR, American symbol
REG1 = linear:78*: Positive VOLTAGE REGULATOR Source: http://cache.national.com/ds/LM/LM78L05.pdf http://www.fairchildsemi.com/ds/LM/LM7805.pdf
REG2 = linear:MC79M: 500 mA Negative Voltage Regulators Source: Data sheet <http://www.onsemi.com/pub_link/Collateral/MC79M00-D.PDF>
REG3 = national-semiconductor:LM2596: SIMPLE SWITCHER® Power Converter 150 kHz 3A Step-Down Voltage Regulator Source: http://www.national.com/ds/LM/LM2596.pdf; MPN: LM2596T-ADJ/LF02; OC_FARNELL: 9494162; OC_NEWARK: 65K5910
S1-S19 = tr909:MX1A_CHERRY_SW_LED
S20-S36 = tr909:ZTSN_SW_LED
SW8-SW11 = Yocto_v2.003:MSS42_SW_4PDT: MSS42 4PDT switch
TEST_MODE = jumper:JP2E: JUMPER
TM1 TM1* TM2* TM3 TM4 = TR808clone:TRIM_EU-: POTENTIOMETER
TM2 = pot:TRIM_US-: POTENTIOMETER
TM5 = Yocto_v2.003:TRIM_EU-: POTENTIOMETER
U1-U3 U5-U8 U10-U21 U24 U25 U27 = TR808clone:µPC4558C: Dual Operational Amplifier
U4 = TR808clone:4584: Hex SCHMITT TRIGGER (74C14)
U9 U22 = TR808clone:BA6110
U23 = TR808clone:AN6912: Quad Comparator
VR28 = tr909:POT_DUAL
VR29 = tr909:PEC16_ENCODER: BOURNS Rotary encoder with switch serie PEC16
X1 = special:XTAL/S: CRYSTAL

## Net classes
0 default: width 0.381 mm, drill 0.254 mm, clearance 0.254 mm
1 GND: width 0.762 mm, drill 0.254 mm, clearance 0.381 mm
2 power: width 0.61 mm, drill 0.381 mm, clearance 0.381 mm
3 special: width 0.254 mm, drill 0.254 mm, clearance 0.254 mm
4 NOISE: width 0.381 mm, drill 0.254 mm, clearance 0.508 mm
5 isolate: width 0.381 mm, drill 0.254 mm, clearance 1.016 mm